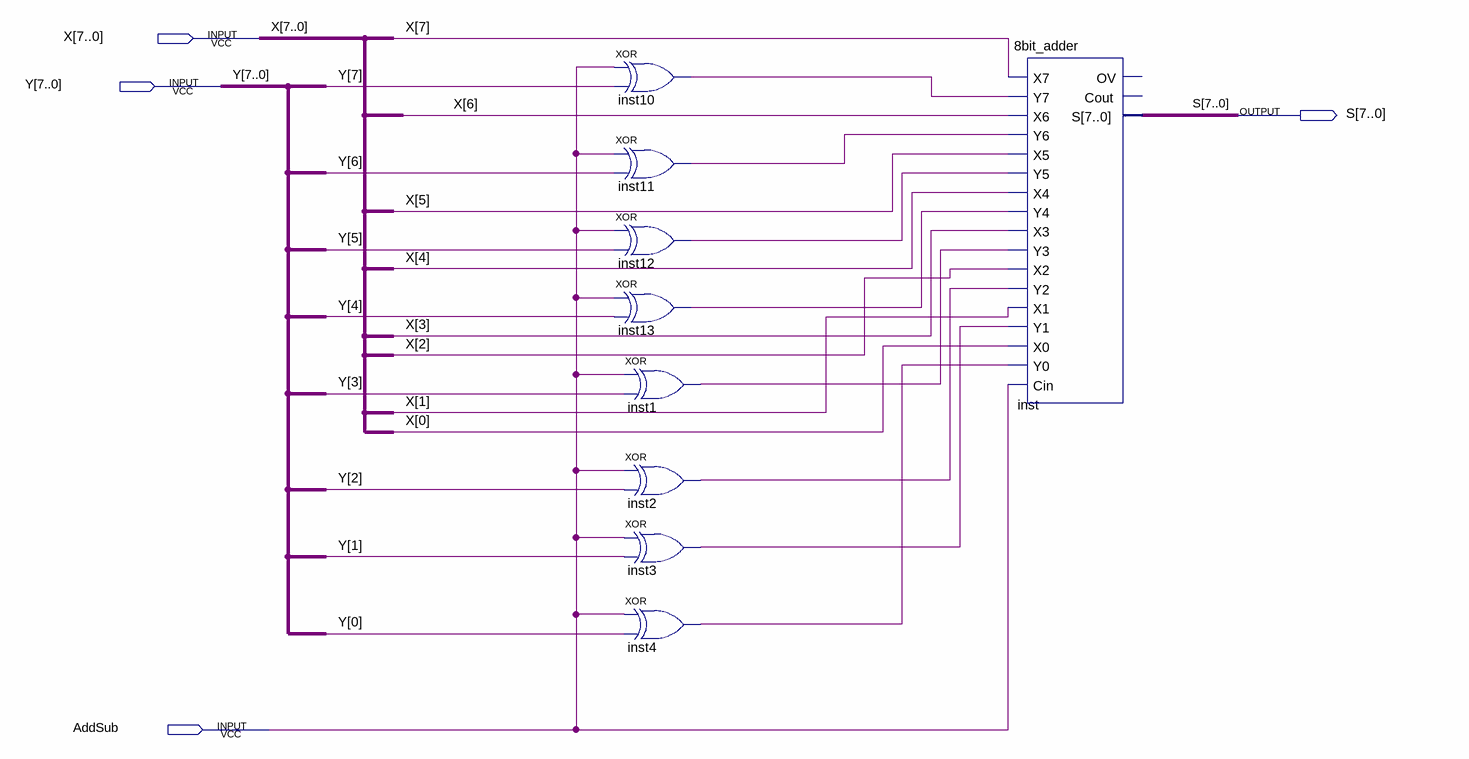
[diagram p0: schematic sheet]
// Quartus schematic 8bit_addsub.bdf as structural Verilog: 9 symbols, 4 pins
module \8bit_addsub  (
  input  [7:0] X,
  input  [7:0] Y,
  input  AddSub,
  output [7:0] S
);

  wire inst1_out, inst2_out, inst3_out, inst4_out, inst10_out, inst11_out, inst12_out, inst13_out;

  xor inst10 (inst10_out, AddSub, Y[7]);
  xor inst11 (inst11_out, AddSub, Y[6]);
  xor inst12 (inst12_out, AddSub, Y[5]);
  xor inst13 (inst13_out, AddSub, Y[4]);
  xor inst1 (inst1_out, AddSub, Y[3]);
  xor inst2 (inst2_out, AddSub, Y[2]);
  xor inst3 (inst3_out, AddSub, Y[1]);
  xor inst4 (inst4_out, AddSub, Y[0]);
  \8bit_adder  inst (
    .X7(X[7]), .Y7(inst10_out), .X6(X[6]), .Y6(inst11_out), .X5(X[5]), .Y5(inst12_out), .X4(X[4]),
    .Y4(inst13_out), .X3(X[3]), .Y3(inst1_out), .X2(X[2]), .Y2(inst2_out), .X1(X[1]), .Y1(inst3_out),
    .X0(X[0]), .Y0(inst4_out), .Cin(AddSub), .S(S));  // open: OV, Cout
endmodule
